# Altium schematic sheet pressure_temp_uv.SchDoc: UV Sensor
size A4; CheckedBy: rrodrigu; Author: Satxo; CompanyName: Satxo; Revision: 0v1; SheetNumber: 7; SheetTotal: 8; ProjectName: Basestation
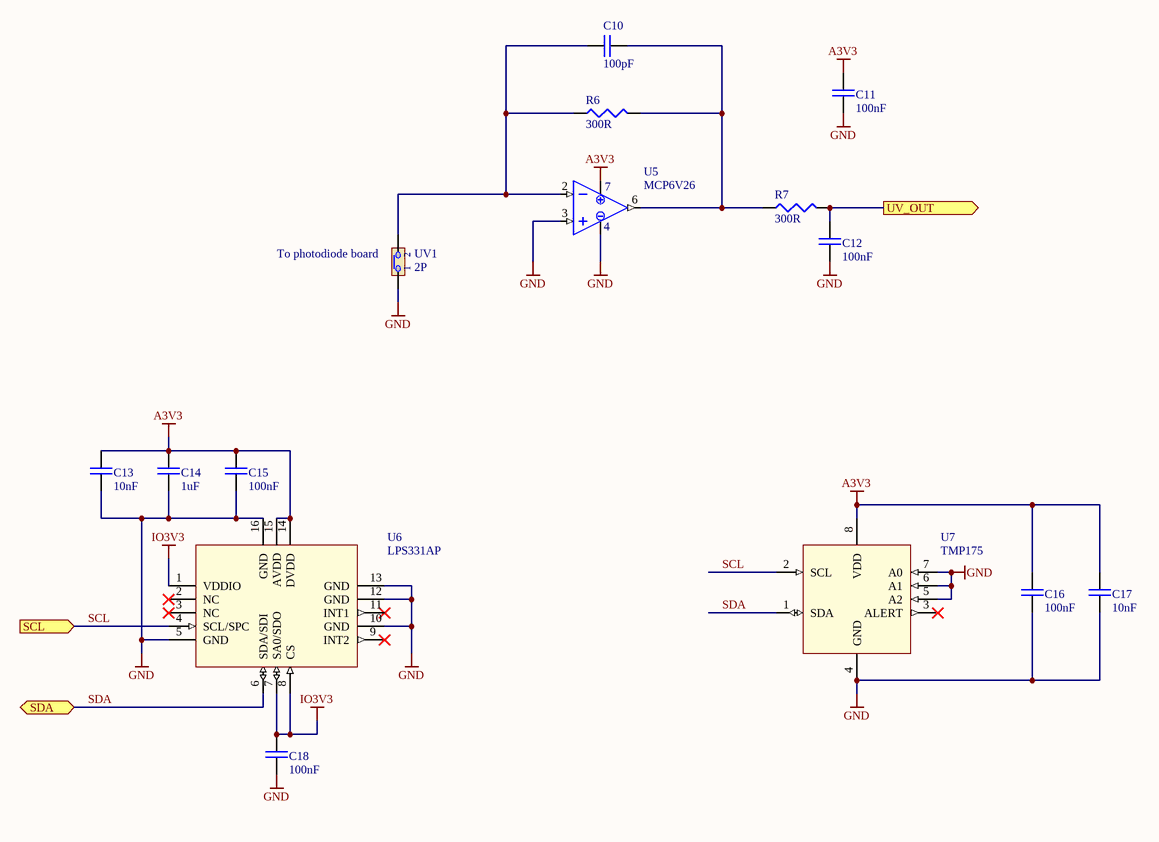
[diagram p0: pressure_temp_uv.SchDoc]

## Parts
C10  100pF  [0603]
C11  100nF  [0603]
C12  100nF  [0603]
C13  10nF  [0603]
C14  1uF  [0603]
C15  100nF  [0603]
C16  100nF  [0603]
C17  10nF  [0603]
C18  100nF  [0603]
R6  300R  [0603]
R7  300R  [0603]
U5  MCP6V26  [SOIC-8]
U6  LPS331AP  [HCLGA-16]
U7  TMP175  [SOIC-8]
UV1  2P  [SIP-2]

## Ports
SCL (in), SDA (bidir), UV_OUT (out)

## Nets
A3V3: C11.2 C13.2 C14.2 C15.2 C16.2 C17.2 U5.7(VDD) U6.14(DVDD) U6.15(AVDD) U7.8(VDD)
GND: C11.1 C12.1 C13.1 C14.1 C15.1 C16.1 C17.1 C18.1 U5.3(INP) U5.4(VSS) U6.5(GND) U6.10(GND) U6.12(GND) U6.13(GND) U6.16(GND) U7.4(GND) U7.5(A2) U7.6(A1) U7.7(A0) UV1.1
IO3V3: C18.2 U6.1(VDDIO) U6.7(SA0/SDO) U6.8(CS)
SCL: U6.4(SCL/SPC) U7.2(SCL) ; port SCL
SDA: U6.6(SDA/SDI) U7.1(SDA) ; port SDA
UV_OUT: C12.2 R7.2 ; port UV_OUT
NetC10_1: C10.1 R6.1 U5.2(INN) UV1.2
NetC10_2: C10.2 R6.2 R7.1 U5.6(VOUT)

Not connected (* = marked no-connect by the designer): U6 2(NC)* 3(NC)* 9(INT2)* 11(INT1)*; U7 3(ALERT)*

## Notes on the sheet
- (near UV1) To photodiode board
- Title
- Size:
- Date:
- A4
- Number:
- Time:
- Revision:
- Sheet
- of
- File:

## Library data of the parts
C10-C18 = CAP: Capacitor; Owner: Nuno Brum; Sub-Type: Ceramic; Assembly: INS; Maximum Voltage: *; Creation Date: 2005-04-28; Status: Valid; Validation date: 2006-05-15; Type: Capacitor
R6 R7 = RES: Resistor; Owner: Nuno Brum; Sub-Type: Generic; Assembly: INS; Validation date: 2006-05-15; Creation Date: 2002-07-17; Status: Valid; Power: *; Type: Resistor
U5 = MCP6V26: Low-Offset Opamp; Type: IC; Creation Date: 2012-03-15
U6 = LPS331AP: Pressure sensor, 260 - 1260 mbar; Creation Date: 2012-12-06; Type: IC
U7 = TMP175: Digital Temperature Sensor; Type: IC; Creation Date: 2012-03-05
UV1 = JMP2: 2-pin Jumper; Owner: Nuno Brum; Sub-Type: Connector; STATE1: 1; Assembly: INS; Validation Date: 2006-05-15; Creation Date: 2002-07-17; Status: Valid; Type: Electrical & Mechanical